# EAGLE design LACE_mod_usb (EAGLE 5.07)
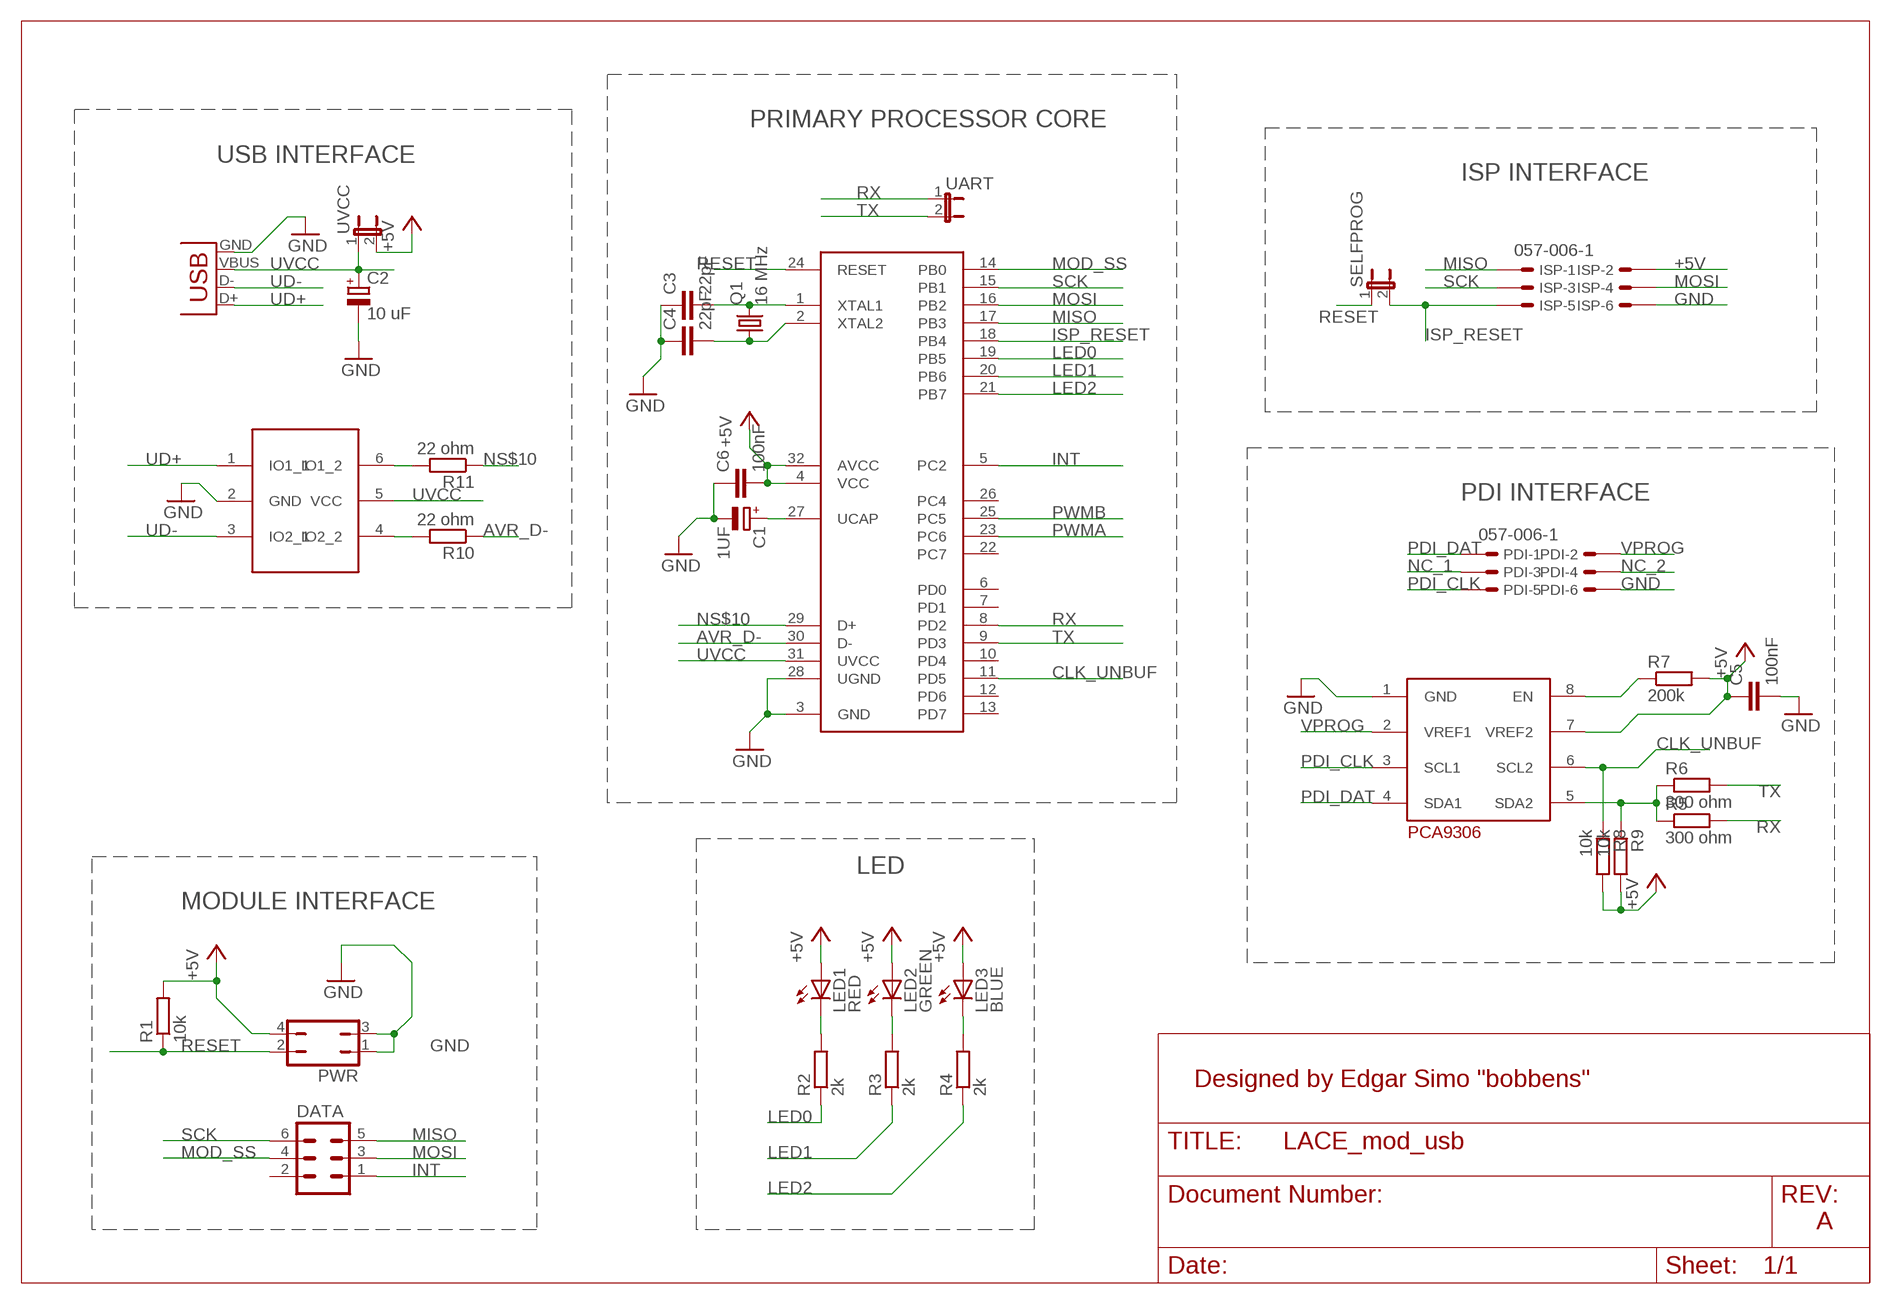
[diagram p0: schematic, sheet 1]

## Parts
C1  1UF  CPOL-EUE1.8-4  [E1,8-4]
C2  10 uF  CPOL-EUE1.8-4  [E1,8-4]
C3  22pF  C-EUC0805  [C0805]
C4  22pF  C-EUC0805  [C0805]
C5  100nF  C-EUC0805  [C0805]
C6  100nF  C-EUC0805  [C0805]
DATA  MA03-2  [MA03-2]
ISP  057-006-1  [057-006-1]
LED1  RED  LEDCHIP-LED0805  [CHIP-LED0805]
LED2  GREEN  LEDCHIP-LED0805  [CHIP-LED0805]
LED3  BLUE  LEDCHIP-LED0805  [CHIP-LED0805]
PDI  057-006-1  [057-006-1]
PWR  JP2Q  [JP2Q]
Q1  16 MHz  CRYSTALHC49S  [HC49/S]
R1  10k  R-EU_R0805  [R0805]
R2  2k  R-EU_R0805  [R0805]
R3  2k  R-EU_R0805  [R0805]
R4  2k  R-EU_R0805  [R0805]
R5  300 ohm  R-EU_R0805  [R0805]
R6  300 ohm  R-EU_R0805  [R0805]
R7  200k  R-EU_R0805  [R0805]
R8  10k  R-EU_R0805  [R0805]
R9  10k  R-EU_R0805  [R0805]
R10  22 ohm  R-EU_R0805  [R0805]
R11  22 ohm  R-EU_R0805  [R0805]
SELFPROG  JP1E  [JP1]
U$1  AT90USB162  [VQFP32]
U$2  USBLC  [SOT23-6L]
U$3  PCA9306  [R-PDSO-G08]
UART  JP1E  [JP1]
UVCC  JP1E  [JP1]
X1  USB-A-S  [USB-A-S]

## Nets
+5V: C5.1 C6.2 ISP.2 LED1.A LED2.A LED3.A PWR.4 R1.2 R7.2 R8.2 R9.2 U$1.4(VCC) U$1.32(AVCC) U$3.7(VREF2) UVCC.2
AVR_D-: R10.1 U$1.30(D-)
CLK_UNBUF: R8.1 U$1.11(PD5) U$3.6(SCL2)
GND: C1.- C2.- C3.1 C4.1 C5.2 C6.1 ISP.6 PDI.6 PWR.1 PWR.3 U$1.3(GND) U$1.28(UGND) U$2.2(GND) U$3.1(GND) X1.GND
INT: DATA.1 U$1.5(PC2)
ISP_RESET: ISP.5 SELFPROG.2 U$1.18(PB4)
LED0: R2.1 U$1.19(PB5)
LED1: R3.1 U$1.20(PB6)
LED2: R4.1 U$1.21(PB7)
MISO: DATA.5 ISP.1 U$1.17(PB3)
MOD_SS: DATA.4 U$1.14(PB0)
MOSI: DATA.3 ISP.4 U$1.16(PB2)
N$1: C1.+ U$1.27(UCAP)
N$2: LED1.C R2.2
N$3: C3.2 Q1.2 U$1.1(XTAL1)
N$4: C4.2 Q1.1 U$1.2(XTAL2)
N$5: LED2.C R3.2
N$6: LED3.C R4.2
N$7: R10.2 U$2.4(IO2_2)
N$8: R5.1 R6.1 R9.1 U$3.5(SDA2)
N$9: R7.1 U$3.8(EN)
N$10: R11.2 U$2.6(IO1_2)
NC_1: PDI.3
NC_2: PDI.4
NS$10: R11.1 U$1.29(D+)
PDI_CLK: PDI.5 U$3.3(SCL1)
PDI_DAT: PDI.1 U$3.4(SDA1)
PWMA: U$1.23(PC6)
PWMB: U$1.25(PC5)
RESET: PWR.2 R1.1 SELFPROG.1 U$1.24(RESET)
RX: R5.2 U$1.8(PD2) UART.1
SCK: DATA.6 ISP.3 U$1.15(PB1)
TX: R6.2 U$1.9(PD3) UART.2
UD+: U$2.1(IO1_1) X1.D+
UD-: U$2.3(IO2_1) X1.D-
UVCC: C2.+ U$1.31(UVCC) U$2.5(VCC) UVCC.1 X1.VBUS
VPROG: PDI.2 U$3.2(VREF1)
Unconnected: DATA.2 U$1.6(PD0) U$1.7(PD1) U$1.10(PD4) U$1.12(PD6) U$1.13(PD7) U$1.22(PC7) U$1.26(PC4)

## Notes on the sheet
- PRIMARY PROCESSOR CORE
- USB INTERFACE
- ISP INTERFACE
- PDI INTERFACE
- LED
- MODULE INTERFACE
- Designed by Edgar Simo "bobbens"
- A

## Library data of the parts
C1 C2 = rcl:CPOL-EU: POLARIZED CAPACITOR, European symbol
C3-C6 = rcl:C-EU: CAPACITOR, European symbol
DATA = con-lstb:MA03-2: PIN HEADER
ISP PDI = con-panduit:057-006-: CONNECTOR 6-pin series 057 contact pc board low profile headers
LED1-LED3 = led:LED: LED OSRAM: - CHIPLED LG R971, LG N971, LY N971, LG Q971, LY Q971, LO R971, LY R971 LH N974, LH R974 LS Q976, LO Q976, LY Q976 LO Q996 - Hyper CHIPLED LW Q18S LB Q993, LB Q99A, LB R99A - SideLED LS A670, LO A670, LY A670, LG A670, LP A670 LB A673, LV A673, LT A673, LW A673 LH A674 LY A675 LS A676, LA A676, LO A676, LY A676, LW A676 LS A679, LY A679, LG A679 - Hyper Micro SIDELED® LS Y876, LA Y876, LO Y876, LY Y876 LT Y87S - SmartLED LW L88C, LW L88S LB L89C, LB L89S, LG L890 LS L89K, LO L89K, LY L89K LS L896, LA L896, LO L896, LY L896 - TOPLED LS T670, LO T670, LY T670, LG T670, LP T670 LSG T670, LSP T670, LSY T670, LOP T670, LYG T670 LG T671, LOG T671, LSG T671 LB T673, LV T673, LT T673, LW T673 LH T674 LS T676, LA T676, LO T676, LY T676, LB T676, LH T676, LSB T676, LW T676 LB T67C, LV T67C, LT T67C, LS T67K, LO T67K, LY T67K, LW E67C LS E67B, LA E67B, LO E67B, LY E67B, LB E67C, LV E67C, LT E67C LW T67C LS T679, LY T679, LG T679 LS T770, LO T770, LY T770, LG T770, LP T770 LB T773, LV T773, LT T773, LW T773 LH T774 LS E675, LA E675, LY E675, LS T675 LS T776, LA T776, LO T776, LY T776, LB T776 LHGB T686 LT T68C, LB T68C - Hyper Mini TOPLED® LB M676 - Mini TOPLED Santana® LG M470 LS M47K, LO M47K, LY M47K Source: http://www.osram.convergy.de LUXEON: - LUMILED® LXK2-PW12-R00, LXK2-PW12-S00, LXK2-PW14-U00, LXK2-PW14-V00 LXK2-PM12-R00, LXK2-PM12-S00, LXK2-PM14-U00 LXK2-PE12-Q00, LXK2-PE12-R00, LXK2-PE12-S00, LXK2-PE14-T00, LXK2-PE14-U00 LXK2-PB12-K00, LXK2-PB12-L00, LXK2-PB12-M00, LXK2-PB14-N00, LXK2-PB14-P00, LXK2-PB14-Q00 LXK2-PR12-L00, LXK2-PR12-M00, LXK2-PR14-Q00, LXK2-PR14-R00 LXK2-PD12-Q00, LXK2-PD12-R00, LXK2-PD12-S00 LXK2-PH12-R00, LXK2-PH12-S00 LXK2-PL12-P00, LXK2-PL12-Q00, LXK2-PL12-R00 Source: www.luxeon.com KINGBRIGHT: KA-3528ASYC Source: www.kingbright.com
PWR = jumper:JP2Q: JUMPER
Q1 = crystal:CRYSTAL: CRYSTAL
R1-R11 = rcl:R-EU_: RESISTOR, European symbol
SELFPROG UART UVCC = jumper:JP1E: JUMPER
U$1 = at90usb:AT90USB162
U$2 = usblc:USBLC
U$3 = usblc:PCA9306
X1 = SparkFun:USB: USB Connectors USB-B-PTH is fully proven SKU : PRT-00139 USB-miniB is fully proven SKU : PRT-00587 USB-A-PCB is untested. USB-A-H is throughly reviewed, but untested. Spark Fun Electronics SKU : PRT-00437 USB-B-SMT is throughly reviewed, but untested. Needs silkscreen touching up. USB-A-S has not been used/tested USB-MB-H has not been used/tested

## Board
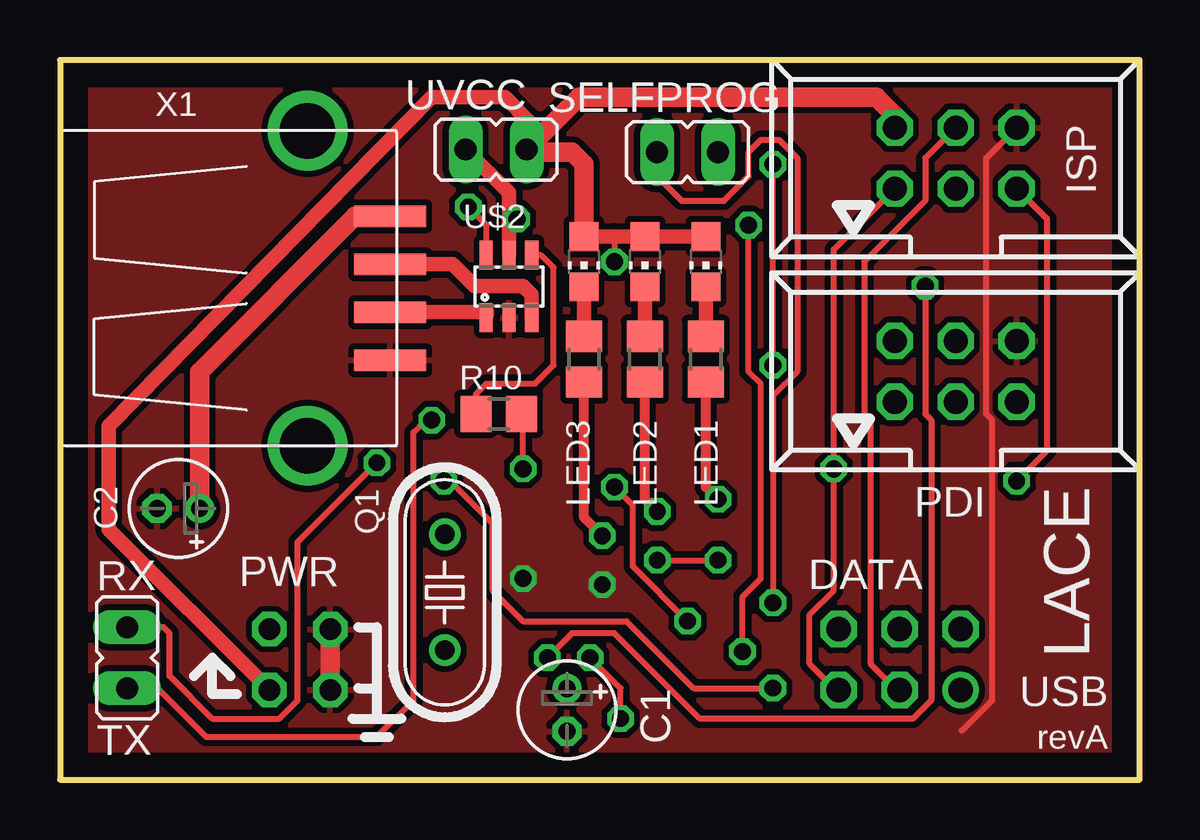
[diagram p1: board, top side]
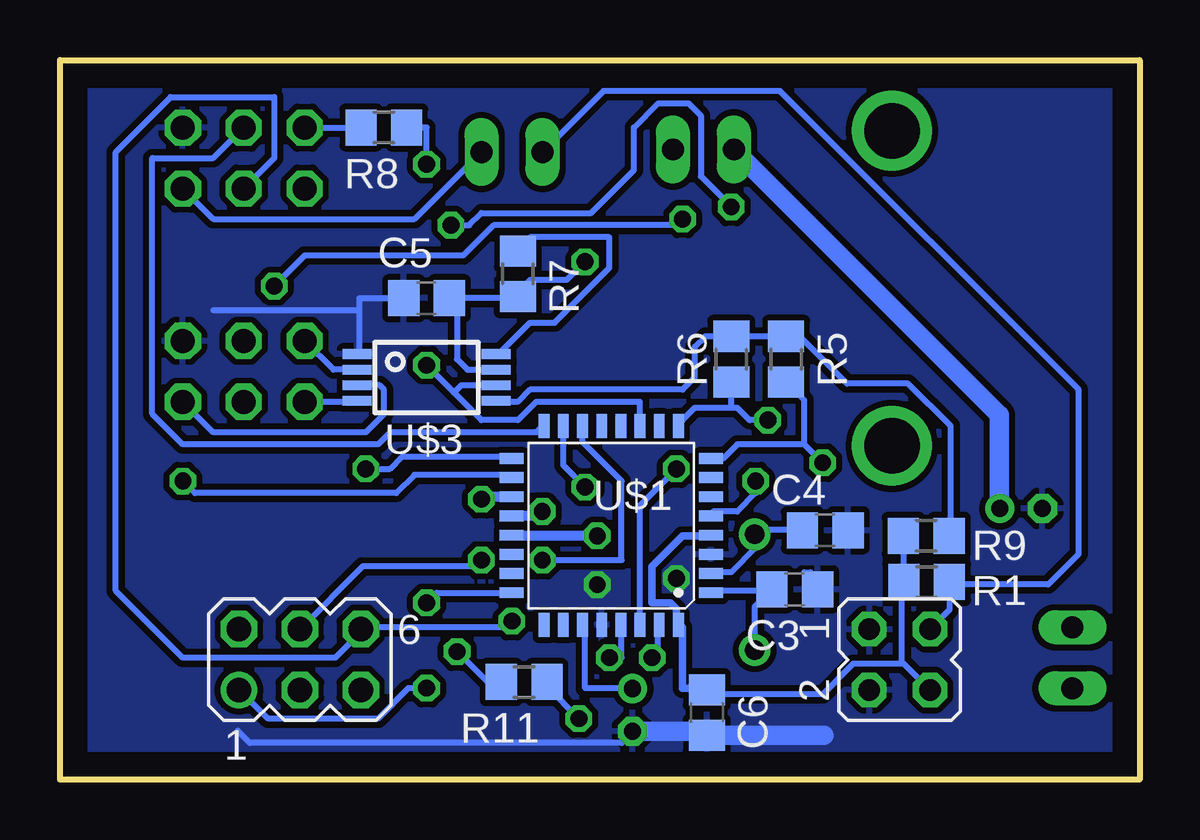
[diagram p2: board, bottom side, seen from below]

Size 45 x 30 mm. Coordinates in mm from the lower left corner, seen from the top.
Outline: 0,0 45,0 45,30 0,30 0,0
Copper layers (1*16): Top 0.035mm / dielectric 1.5mm / Bottom 0.035mm
Design rules "8mils *": minimum track width 8mil, minimum drill 0.7mm, track to track 8mil, track to pad 8mil, pad to pad 8mil, via to via 8mil, smd to smd 8mil, copper to edge 40mil, drill to drill 10mil, minimum pad ring 10mil, minimum via ring 8mil, stop-mask expansion 0mil, vias tented up to drill 0mil, thermal gap 10mil

### Footprints (pad centres in the part's own frame; a part is rotated, then mirrored left to right if it is on the bottom)
E1,8-4 = drill 0.711 pad 1.168 round: + -0.889,0 | drill 0.711 pad 1.168 octagon: - 0.889,0
C0805 = smd 1.3 x 1.5: 1 -0.95,0; 2 0.95,0
MA03-2 = drill 1.016 round: 1 -2.54,-1.27 | drill 1.016 octagon: 2 -2.54,1.27; 3 0,-1.27; 4 0,1.27; 5 2.54,-1.27; 6 2.54,1.27
057-006-1 = drill 1 octagon: 1 -2.54,-1.27; 2 -2.54,1.27; 3 0,-1.27; 4 0,1.27; 5 2.54,-1.27; 6 2.54,1.27
CHIP-LED0805 = smd 1.2 x 1.2: A 0,-1.05; C 0,1.05
JP2Q = drill 0.914 octagon: 1 -1.27,-1.27; 2 -1.27,1.27; 3 1.27,-1.27; 4 1.27,1.27
HC49/S = drill 0.813 round: 1 -2.413,0; 2 2.413,0
R0805 = smd 1.3 x 1.5: 1 -0.95,0; 2 0.95,0
JP1 = drill 0.914 long: 1 0,-1.27; 2 0,1.27
VQFP32 = smd 1 x 0.45: 1 -4.15,2.8; 2 -4.15,2; 3 -4.15,1.2; 4 -4.15,0.4; 5 -4.15,-0.4; 6 -4.15,-1.2; 7 -4.15,-2; 8 -4.15,-2.8; 17 4.15,-2.8; 18 4.15,-2; 19 4.15,-1.2; 20 4.15,-0.4; 21 4.15,0.4; 22 4.15,1.2; 23 4.15,2; 24 4.15,2.8 | smd 0.45 x 1: 9 -2.8,-4.15; 10 -2,-4.15; 11 -1.2,-4.15; 12 -0.4,-4.15; 13 0.4,-4.15; 14 1.2,-4.15; 15 2,-4.15; 16 2.8,-4.15; 25 2.8,4.15; 26 2,4.15; 27 1.2,4.15; 28 0.4,4.15; 29 -0.4,4.15; 30 -1.2,4.15; 31 -2,4.15; 32 -2.8,4.15
SOT23-6L = smd 0.55 x 1.2: 1 -0.95,-1.3; 2 0,-1.3; 3 0.95,-1.3; 4 0.95,1.3; 5 0,1.3; 6 -0.95,1.3
R-PDSO-G08 = smd 0.4 x 1.2: 1 -0.975,-2.9; 2 -0.325,-2.9; 3 0.325,-2.9; 4 0.975,-2.9; 5 0.975,2.9; 6 0.325,2.9; 7 -0.325,2.9; 8 -0.975,2.9
USB-A-S = smd 3 x 0.9: D+ 3.45,-1; D- 3.45,1; GND 3.45,-3; VBUS 3.45,3 | drill 2.311 round: P$5 0,-6.566; P$6 0,6.566

### Placement (x,y rotation side)
C1  21.13,2.9 270 top
C2  4.93,11.3 180 top
C3  14.37,7.93 180 bottom
C4  13.1,10.39 180 bottom
C5  29.72,20.07 180 bottom
C6  18.03,2.79 90 bottom
DATA  35,5 0 bottom
ISP  37.34,25.91 0 top
LED1  26.92,21.59 180 top
LED2  24.38,21.59 180 top
LED3  21.84,21.59 180 top
PDI  37.34,17.02 0 top
PWR  10,5 270 bottom
Q1  16.04,7.81 270 top
R1  8.88,8.24 180 bottom
R2  26.92,17.53 90 top
R3  24.38,17.53 90 top
R4  21.84,17.53 90 top
R5  14.73,17.53 270 bottom
R6  17.02,17.53 270 bottom
R7  25.91,21.08 270 bottom
R8  31.5,27.18 180 bottom
R9  8.89,10.16 180 bottom
R10  18.29,15.24 180 top
R11  25.65,4.06 180 bottom
SELFPROG  26.16,26.16 270 top
U$1  22.02,10.59 180 bottom
U$2  18.72,20.56 0 top
U$3  29.72,16.76 270 bottom
UART  2.79,5.08 180 top
UVCC  18.18,26.27 270 top
X1  10.32,20.48 0 top

### Tracks (layer width: path | path; a pad name or v marks a point on that pad's centre or on a via)
+5V  (via drill 0.7)
  Top 0.254: 23.11,22.64 v23.11,21.59
  Top 0.61: 19.56,26.38 UVCC.2 19.56,26.16 19.56,27.43 18.54,28.45 15.49,28.45 2.03,14.73 2.03,10.43 PWR.4 | LED3.A 23.11,22.64 LED2.A LED1.A
  Top 0.813: 19.56,26.38 19.56,27.18 | LED3.A 21.84,25.65 21.34,26.16 19.56,26.16 | ISP.2 34.8,27.69 34.04,28.45 21.63,28.45 UVCC.2
  Bottom 0.254: 18.03,10.16 U$1.4 | U$1.32 19.3,6.6 | ISP.2 R8.2 | v23.11,21.59 23.88,20.83 25.4,20.83 25.91,20.32 R7.2 25.91,20.07 C5.1 28.45,19.75 28.45,17.53 28.01,17.09 U$3.7 | C6.2 18.03,3.81 | 17.85,3.56 13.21,3.56 11.94,4.83 9.91,4.83 | 9.91,4.83 9.83,4.83 PWR.4 | R9.2 9.83,10.16 R1.2 9.91,8.24 9.91,4.83
  Bottom 0.305: 18.03,3.81 19.05,3.81 19.05,6.35 U$1.32 | 18.03,10.16 19.05,10.16 20.32,8.89 20.32,7.37 19.56,7.37 19.3,7.11 19.3,6.6 | 17.85,3.56 C6.2
AVR_D-  (via drill 0.7)
  Top 0.254: v19.3,12.95 19.3,14.99
  Top 0.813: R10.1 19.24,15.05 19.3,14.99
  Bottom 0.254: U$1.30 20.83,6.6 20.83,11.43 v19.3,12.95
CLK_UNBUF  (via drill 0.7)
  Top 0.254: v29.72,17.27 v29.72,25.65
  Bottom 0.254: 28.57,16.13 27.43,14.99 25.91,14.99 25.15,15.75 20.83,15.75 20.83,14.99 U$1.11 | 28.57,16.13 v29.72,17.27 | v29.72,25.65 29.72,27.18 R8.1 | U$3.6 28.27,16.44 28.57,16.13
GND  (via drill 0.7)
  Top 0.254: ISP.6 38.61,25.91 38.61,15.24 38.86,14.99 38.86,3.3 37.59,2.03
  Top 0.813: PWR.3 PWR.1
  Bottom 0.254: 13.97,8.64 13.46,8.13 C3.1 | U$1.3 17.78,9.4 | 13.97,8.64 13.72,8.64 | C4.1 12.19,10.16 | C3.1 13.97,8.64 | 11.68,6.35 11.43,6.35 PWR.1 | C3.1 13.21,7.87 | 32.51,19.56 32.51,20.07 C5.2 | 32.51,19.56 32.51,17.78 U$3.1 | 32.51,19.56 38.61,19.56 | 37.59,2.03 37.08,1.52 21.59,1.52 21.34,1.78 C1.-
  Bottom 0.813: C1.- 18.2,2.01 C6.1 13.16,1.84
  other vias: 19.3,8.38 22.61,8.13
  pour Bottom (isolate 0.254): -0.25,-0.25 0,29.97 45.21,29.97 45.21,0
  pour Top (isolate 0.254): 0.25,-0.25 -0.25,29.97 44.96,29.97 44.96,0
INT  (via drill 0.7)
  Top 0.254: v29.72,3.81 26.42,3.81 23.62,6.6 19.3,6.6 18.03,7.87 18.03,10.67 16.26,12.45 v16,12.45
  Bottom 0.254: U$1.5 17.78,11.18 16.76,11.18 16,11.94 v16,12.45 | DATA.1 37.34,3.56 36.32,2.54 31.75,2.54 30.48,3.81 v29.72,3.81
ISP_RESET  (via drill 0.7)
  Top 0.254: v39.88,12.45 41.15,13.72 41.15,23.37 ISP.5
  Bottom 0.254: U$1.18 26.42,12.7 30.23,12.7 30.99,11.94 39.37,11.94 v39.88,12.45 | SELFPROG.2 30.23,23.37 38.61,23.37 ISP.5
LED0  (via drill 0.7)
  Top 0.406: v27.43,11.68 26.92,12.19 R2.1
  Bottom 0.406: U$1.19 27.33,11.79 v27.43,11.68
LED1  (via drill 0.7)
  Top 0.406: v24.89,11.18 24.38,11.68 R3.1
  Bottom 0.406: U$1.20 25.08,10.99 v24.89,11.18
LED2  (via drill 0.7)
  Top 0.406: v22.61,10.16 21.84,10.92 R4.1
  Bottom 0.254: 26.16,10.16 U$1.21
  Bottom 0.406: v22.61,10.16 26.16,10.16
MISO  (via drill 0.7)
  Top 0.254: DATA.5 32.26,3.81 31.24,4.83 31.24,6.86 32.26,7.87 v32.26,12.95 32.26,22.1 ISP.1
  Bottom 0.254: U$1.17 26.42,13.46 30.73,13.46 31.24,12.95 v32.26,12.95
MOD_SS  (via drill 0.7)
  Top 0.254: v24.89,9.14 v27.43,9.14
  Bottom 0.254: v24.89,9.14 21.59,9.14 21.59,12.45 23.22,14.07 U$1.14 23.11,14.73 | v27.43,9.14 27.69,8.89 32.38,8.89 DATA.4
MOSI
  Top 0.254: ISP.4 36.07,25.91 36.07,24.13 33.53,21.59 33.53,15.24 33.78,14.99 33.78,4.83 34.8,3.81 DATA.3
  Bottom 0.254: 25.15,14.48 24.89,14.73 U$1.16 25.08,14.48 31.24,14.48 31.75,13.97 39.88,13.97 41.15,15.24 41.15,25.91 38.61,25.91 ISP.4
N$1
  Bottom 0.254: U$1.27 23.11,6.35 23.11,3.81 21.34,3.81 C1.+
N$2
  Top 0.61: R2.2 LED1.C
N$3
  Bottom 0.254: U$1.1 17.78,7.87 15.49,7.87 C3.2 16.04,7.21 Q1.2
N$4
  Bottom 0.254: U$1.2 18.03,8.64 17.02,8.64 16,9.65 16,10.18 Q1.1 16,10.41 14.22,10.41 C4.2
N$5
  Top 0.61: R3.2 LED2.C
N$6
  Top 0.61: R4.2 LED3.C
N$7
  Top 0.254: U$2.4 20.05,21.86 20.57,21.34 20.57,17.27 19.81,16.51 17.78,16.51 17.34,16.07 R10.2
N$8
  Bottom 0.254: U$3.5 26.67,15.75 25.91,15.75 25.4,16.26 19.05,16.26 18.54,16.76 18.54,18.03 18.1,18.48 R6.1 R5.1 14.16,18.48 12.19,16.51 9.65,16.51 7.87,14.73 7.87,10.16 R9.1
N$9
  Bottom 0.254: U$3.8 26.67,17.78 25.4,19.05 24.38,19.05 22.1,21.34 22.1,22.61 25.4,22.61 25.91,22.1 R7.1
N$10  (via drill 0.7)
  Top 0.254: v28.45,5.33 28.45,7.62 29.21,8.38 29.21,16.51 28.7,17.02 v28.7,23.11 | U$2.6 17.77,23.13 v17.02,23.88
  Bottom 0.254: R11.2 27.18,4.06 v28.45,5.33 | v28.7,23.11 27.94,23.11 27.43,23.62 22.86,23.62 21.08,25.4 21.08,27.18 20.07,28.19 18.8,28.19 18.29,27.69 18.29,25.15 v17.02,23.88
NS$10  (via drill 0.7)
  Top 0.254: v23.37,2.54 23.37,3.81 v22.1,5.08
  Bottom 0.254: v22.1,5.08 21.59,5.08 21.59,6.35 U$1.29 | R11.1 24.7,3.88 v23.37,2.54
PDI_CLK
  Bottom 0.254: PDI.5 38.61,14.48 32.26,14.48 31.5,15.24 31.5,16.26 31.68,16.44 U$3.3
PDI_DAT
  Bottom 0.254: PDI.1 32.77,15.75 U$3.4
RESET  (via drill 0.7)
  Top 0.254: v29.72,7.37 29.72,16 30.73,17.02 30.73,25.91 29.97,26.67 29.21,26.67 28.7,26.16 28.7,25.15 27.69,24.13 25.91,24.13 24.89,25.15 SELFPROG.1
  Bottom 0.254: U$1.24 29.3,7.79 v29.72,7.37 | SELFPROG.1 22.35,28.7 14.99,28.7 2.54,16.26 2.54,9.4 3.81,8.13 7.82,8.13 R1.1 7.93,7.07 PWR.2
RX  (via drill 0.7)
  Top 0.254: v13.21,13.21 9.91,9.91 9.91,3.3 9.14,2.54 6.35,2.54 4.57,4.32 4.57,6.1 4.32,6.35 UART.1
  Bottom 0.254: U$1.8 17.35,13.39 16.76,13.97 13.97,13.97 | v13.21,13.21 13.97,13.97 | 13.97,13.97 13.97,15.81 R5.2
SCK  (via drill 0.7)
  Top 0.254: v26.16,6.6 23.88,8.89 23.88,11.43 v23.11,12.19
  Bottom 0.254: v26.16,6.6 26.42,6.35 32.26,6.35 DATA.6 32.51,6.1 33.53,5.08 39.88,5.08 42.67,7.87 42.67,26.16 40.39,28.45 36.07,28.45 36.07,25.91 ISP.3 | U$1.15 24.02,13.1 v23.11,12.19
TX  (via drill 0.7)
  Top 0.254: v15.49,14.99 15.24,14.99 14.73,14.48 14.73,3.3 13.21,1.78 6.1,1.78 4.06,3.81 UART.2
  Bottom 0.254: 17.02,15.49 18.54,15.49 19.05,14.99 U$1.9 | 17.02,15.49 R6.2 | 17.02,15.49 16.76,15.49 16.26,14.99 v15.49,14.99
UD+
  Top 0.61: X1.D+ 17.8,19.48 U$2.1
UD-
  Top 0.61: X1.D- 16.37,21.48 17.27,20.57 19.3,20.57 19.67,20.21 U$2.3
UVCC  (via drill 0.7)
  Top 0.254: v20.32,5.08 21.34,6.1 23.11,6.1 26.67,2.54 35.56,2.54 36.32,3.3 36.32,14.99 36.07,15.24 v36.07,20.57 | 18.72,23.37 v19.05,23.37
  Top 0.61: U$2.5 18.72,23.37 18.72,24.46 UVCC.1 | X1.VBUS 14.12,23.48
  Top 0.813: C2.+ 5.82,17 12.3,23.48 X1.VBUS
  Bottom 0.254: v20.32,5.08 20.07,5.08 20.07,6.35 U$1.31 | v36.07,20.57 34.8,21.84 28.19,21.84 26.92,23.11 19.3,23.11 v19.05,23.37
  Bottom 0.813: 16.87,26.27 UVCC.1 5.84,15.2 5.84,11.32 C2.+
VPROG
  Bottom 0.254: U$3.2 33.6,17.09 PDI.2

### Text on the board
tNames: RX | LACE | USB | revA | TX